# EAGLE design emitter (EAGLE 7.3.0)
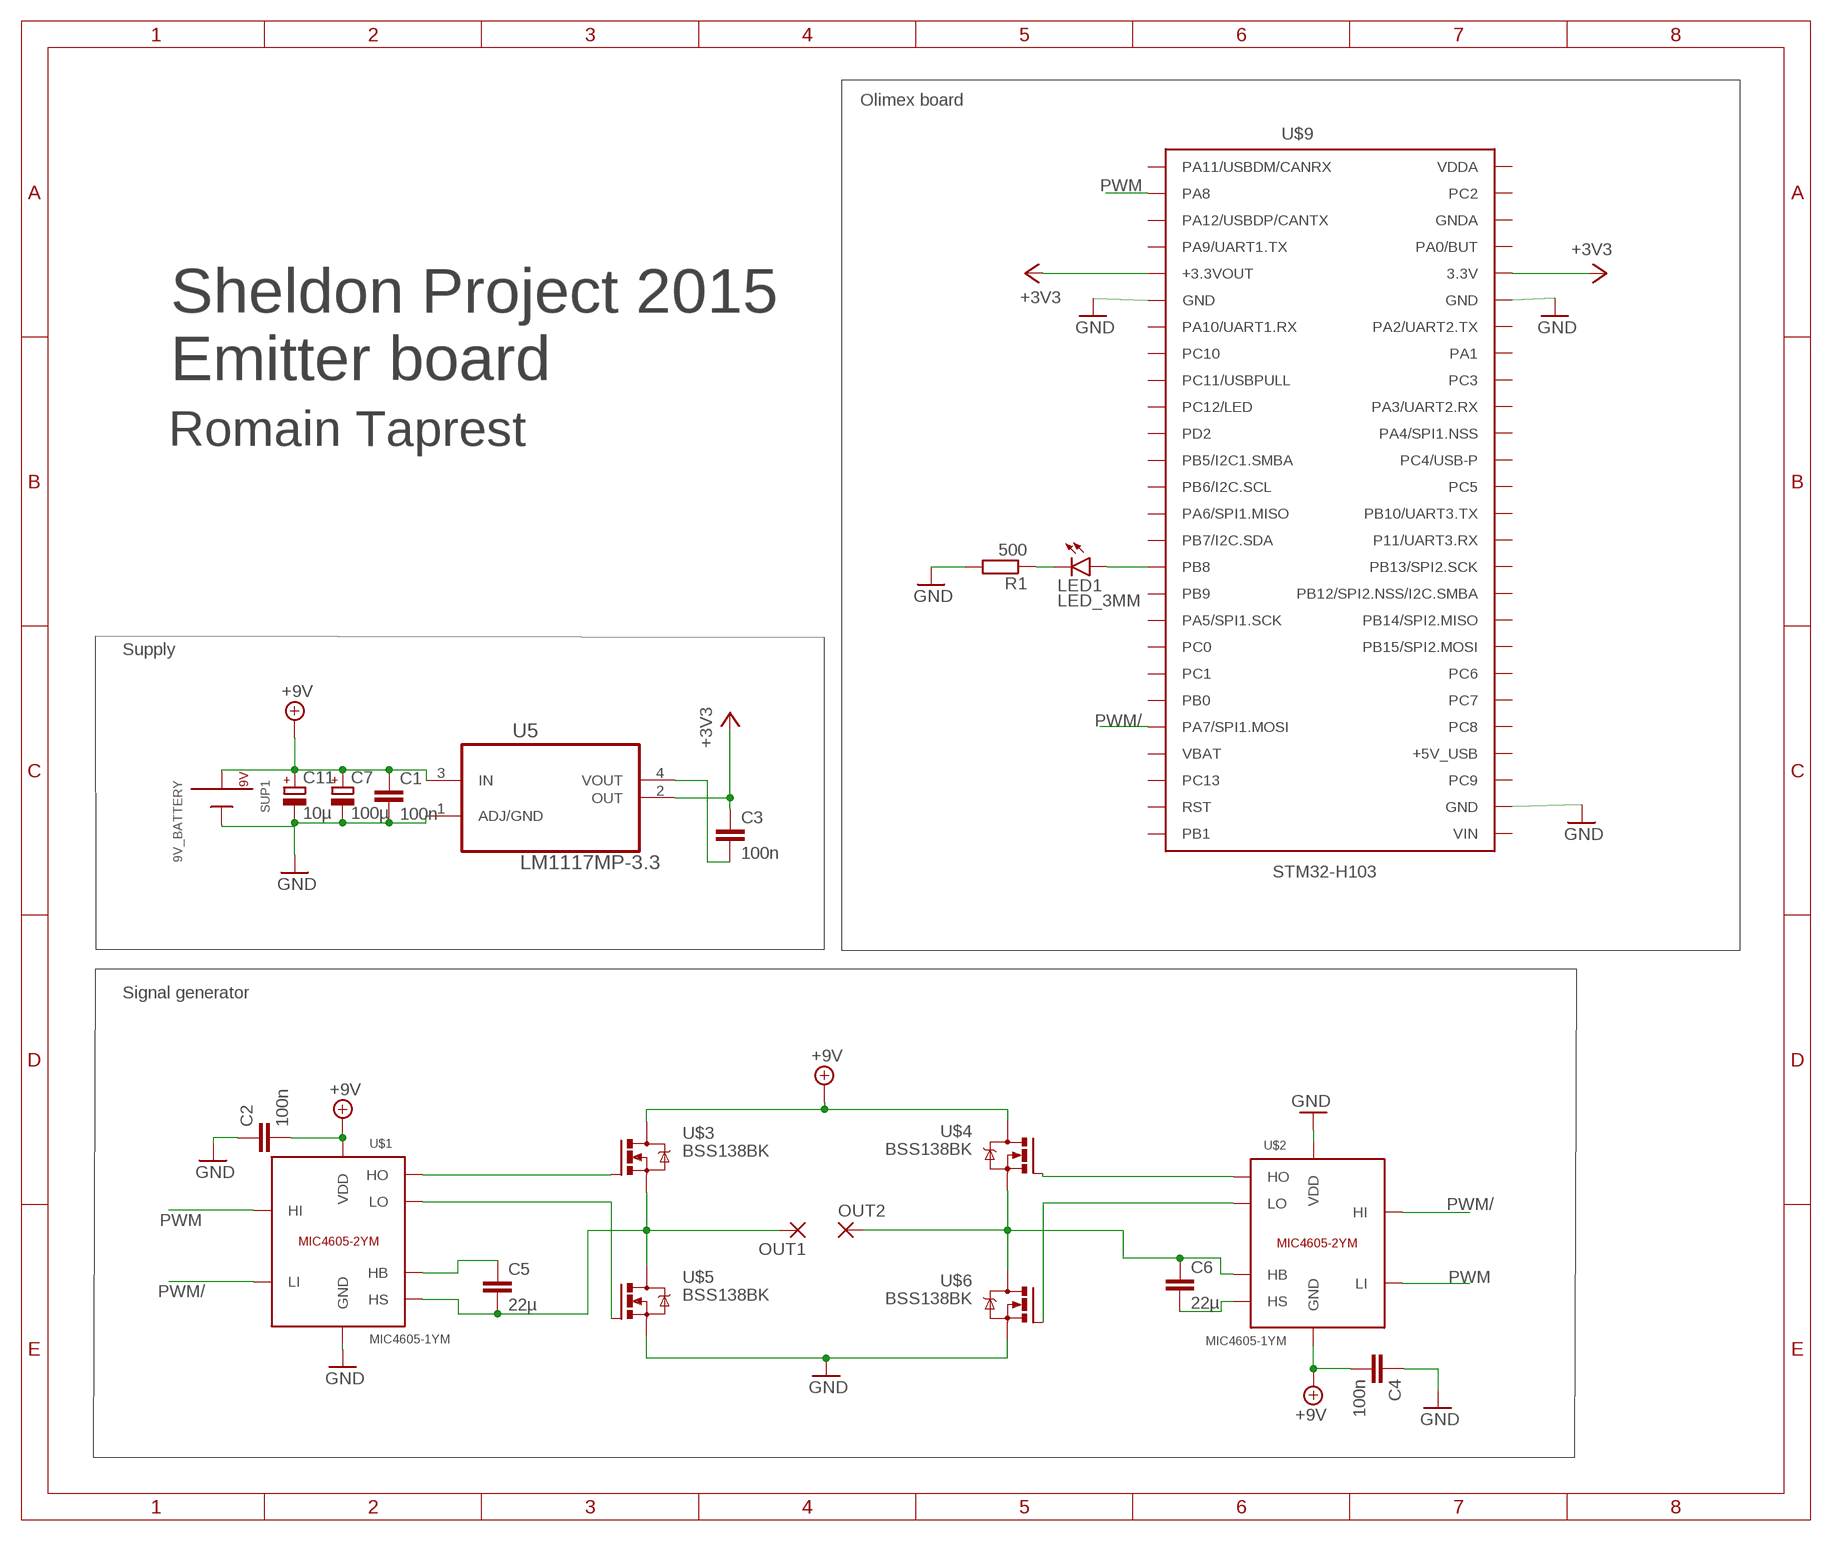
[diagram p0: schematic, sheet 1]

## Parts
C1  100n  C-EU050-025X075  [C050-025X075]
C2  100n  C-EU050-025X075  [C050-025X075]
C3  100n  C-EU050-025X075  [C050-025X075]
C4  100n  C-EU050-025X075  [C050-025X075]
C5  22µ  C-EU050-025X075  [C050-025X075]
C6  22µ  C-EU050-025X075  [C050-025X075]
C7  100µ  CPOL_DIAM5MM  [E2,5-6]
C11  10µ  CPOL_DIAM5MM  [E2,5-6]
LED1  LED_3MM  [LED3MM]
OUT1  2,54/1,0  [2,54/1,0]
OUT2  2,54/1,0  [2,54/1,0]
R1  500  R-EU_0207/10  [0207/10]
SUP1  9V_BATTERY  [9V_BATTERY]
U5  LM1117MP-3.3  [SOT230P696X180-4N]
U$1  MIC4605-1YM  [SOIC08]
U$2  MIC4605-1YM  [SOIC08]
U$3  BSS138BK  [SOT23]
U$4  BSS138BK  [SOT23]
U$5  BSS138BK  [SOT23]
U$6  BSS138BK  [SOT23]
U$9  STM32-H103  [STM32-H103]

## Nets
+3V3: C3.1 U5.2(OUT) U$9.3.3V U$9.+3.3VOUT
+9V: C1.1 C2.2 C4.2 C7.+ C11.+ SUP1.P$1(9V) U5.3(IN) U$1.1(VDD) U$2.7(GND) U$3.3(D) U$4.3(D)
GND: C1.2 C2.1 C4.1 C7.- C11.- R1.2 SUP1.P$2(GND) U5.1(ADJ/GND) U$1.7(GND) U$2.1(VDD) U$5.2(S) U$6.2(S) U$9.GND@1(GND) U$9.GND@2(GND) U$9.GND@3(GND)
N$1: C3.2 U5.4(VOUT)
N$2: LED1.K(C) R1.1
N$3: U$1.3(HO) U$3.1(G)
N$4: U$1.8(LO) U$5.1(G)
N$5: U$2.3(HO) U$4.1(G)
N$6: U$2.8(LO) U$6.1(G)
N$7: C5.1 U$1.2(HB)
N$9: C6.2 U$2.4(HS)
N$13: LED1.A U$9.PB8
OUT1: C5.2 OUT1.1(P) U$1.4(HS) U$3.2(S) U$5.3(D)
OUT2: C6.1 OUT2.1(P) U$2.2(HB) U$4.2(S) U$6.3(D)
PWM: U$1.5(HI) U$2.6(LI) U$9.PA8
PWM/: U$1.6(LI) U$2.5(HI) U$9.PA7/SPI1.MOSI
Unconnected: U$9.+5V_USB U$9.GNDA U$9.P11/UART3.RX U$9.PA0/BUT U$9.PA1 U$9.PA2/UART2.TX U$9.PA3/UART2.RX U$9.PA4/SPI1.NSS U$9.PA5/SPI1.SCK U$9.PA6/SPI1.MISO U$9.PA9/UART1.TX U$9.PA10/UART1.RX U$9.PA11/USBDM/CANRX U$9.PA12/USBDP/CANTX U$9.PB0 U$9.PB1 U$9.PB5/I2C1.SMBA U$9.PB6/I2C.SCL U$9.PB7/I2C.SDA U$9.PB9 U$9.PB10/UART3.TX U$9.PB12/SPI2.NSS/I2C.SMBA U$9.PB13/SPI2.SCK U$9.PB14/SPI2.MISO U$9.PB15/SPI2.MOSI U$9.PC0 U$9.PC1 U$9.PC2 U$9.PC3 U$9.PC4/USB-P U$9.PC5 U$9.PC6 U$9.PC7 U$9.PC8 U$9.PC9 U$9.PC10 U$9.PC11/USBPULL U$9.PC12/LED U$9.PC13 U$9.PD2 U$9.RST U$9.VBAT U$9.VDDA U$9.VIN

## Notes on the sheet
- Olimex board
- Sheldon Project 2015
  Emitter board
- Romain Taprest
- Supply
- Signal generator

## Library data of the parts
C1-C6 = resistor:C-EU: CAPACITOR, European symbol
C7 C11 = @Club_passif:CPOL_
LED1 = @Club_passif:LED_: LEDs, lumière quoi ! 1.8V < Vseuil < 2.0V environ
OUT1 OUT2 = wirepad:2,54/1,0: THROUGH-HOLE PAD
R1 = resistor:R-EU_: RESISTOR, European symbol
SUP1 = libSheldonDrone:9V_BATTERY
U5 = libSheldonDrone:LM1117MP-3.3: Linear regulators; MPN: LM1117MP-3.3; OC_FARNELL: 9778195; OC_NEWARK: 41K3470; PACKAGE: SOT223-3; SUPPLIER: NationalSemiconductor
U$1 U$2 = libSheldonDrone:MIC4605-1YM: MICREL SEMICONDUCTOR MIC4605-1YM DRIVER, MOSFET, 5.5V-16V, SOIC-8; FARNELL: 2382322
U$3-U$6 = libSheldonDrone:BSS138BK: NXP BSS138BK Transistor MOSFET, Canal N, 360 mA, 60 V, 1 ohm, 10 V, 1.1 V; FARNELL: 2053833
U$9 = libSheldonDrone:STM32-H103: Olimex STM32-H103 board

## Board
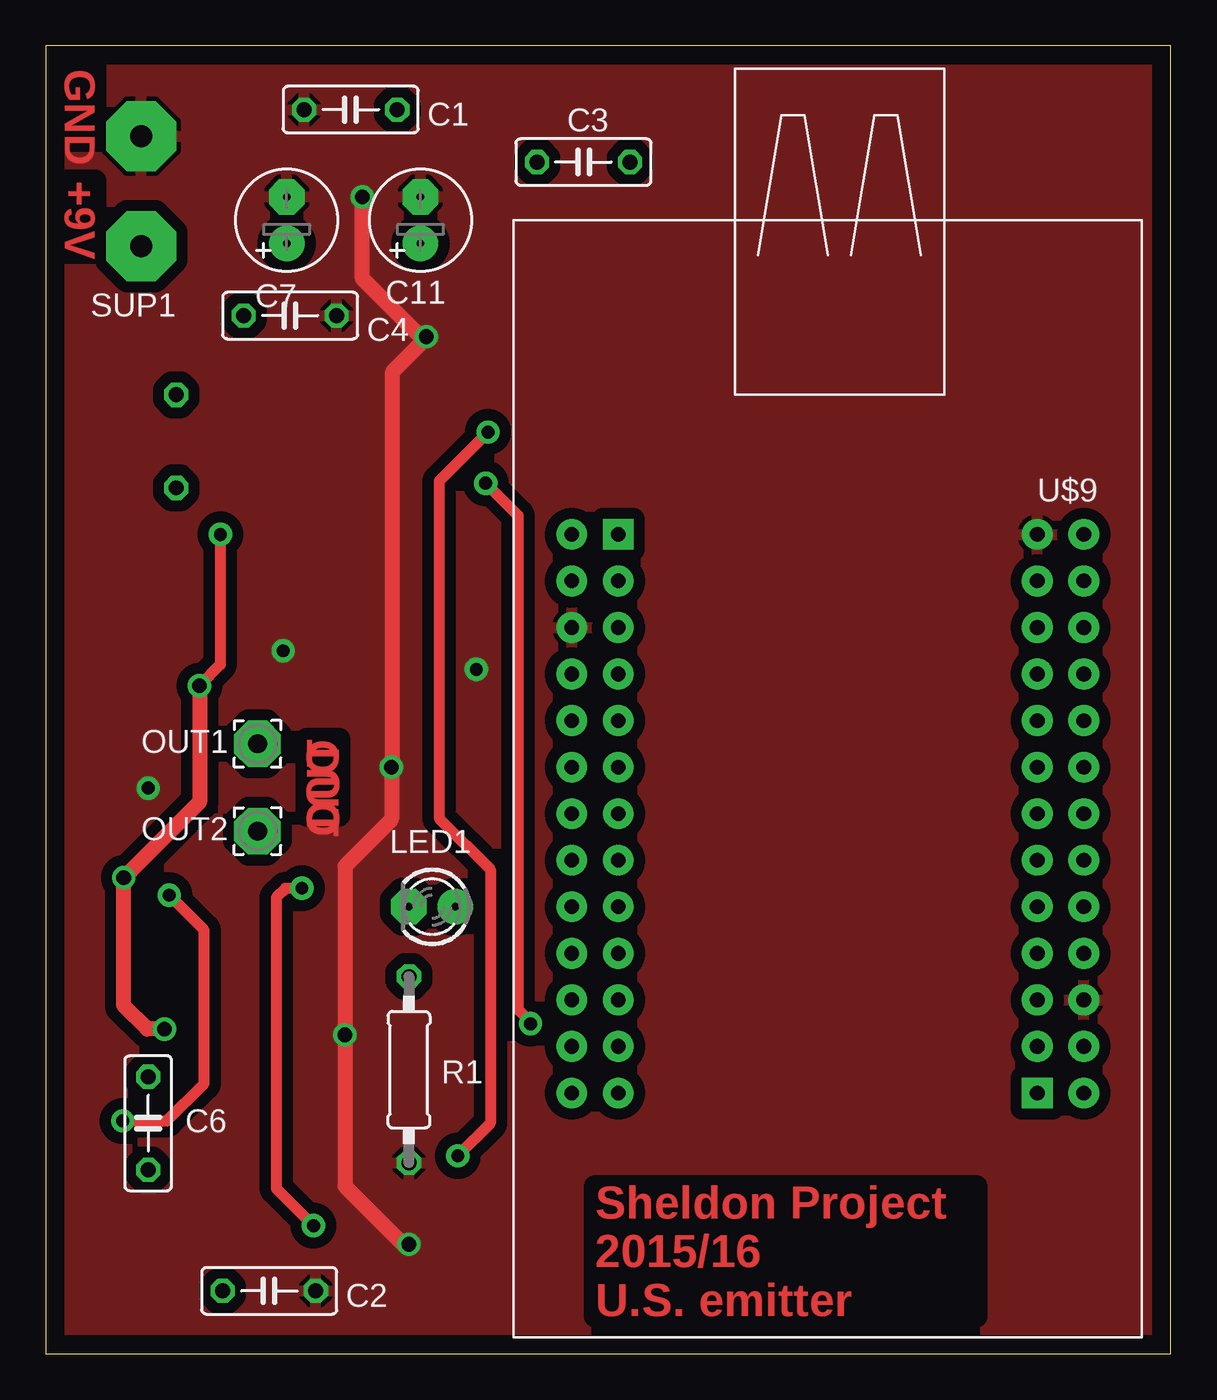
[diagram p1: board, top side]
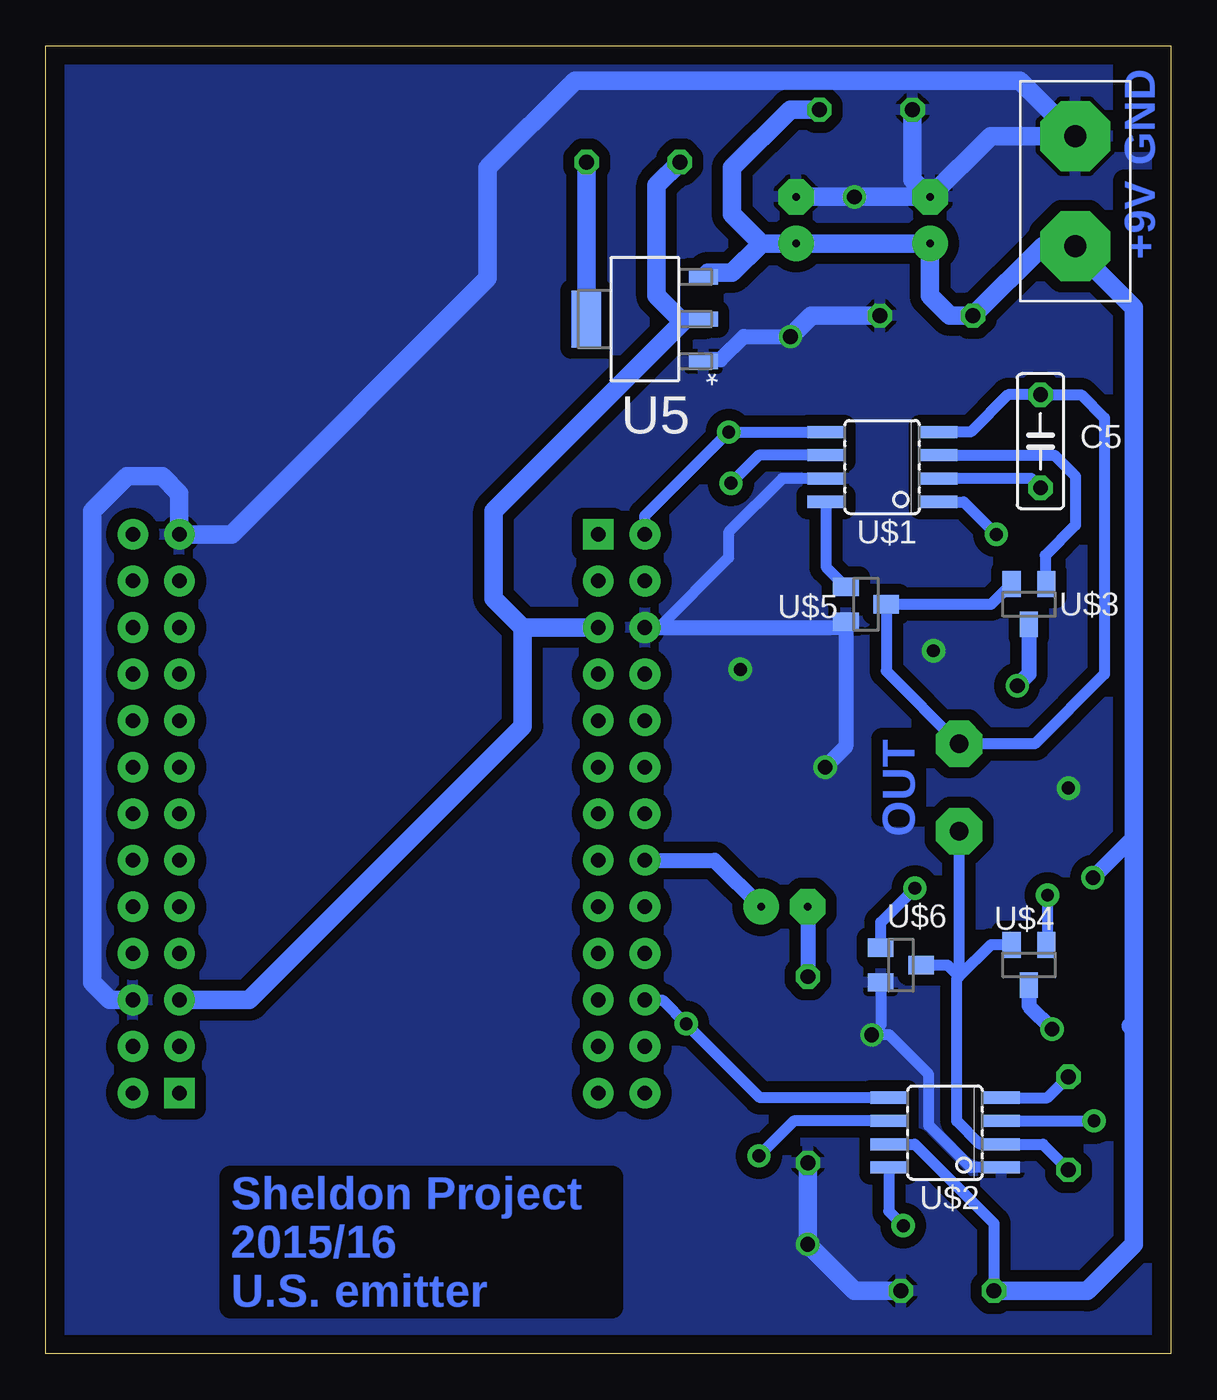
[diagram p2: board, bottom side, seen from below]

Size 61.39 x 71.36 mm. Coordinates in mm from the lower left corner, seen from the top.
Outline: 0,0 61.39,0 61.39,71.36 0,71.36 0,0
Copper layers (1*16): Top 0.035mm / dielectric 1.5mm / Bottom 0.035mm
Design rules "default": minimum track width 10mil, minimum drill 24mil, track to track 8mil, track to pad 8mil, pad to pad 8mil, via to via 8mil, smd to smd 8mil, copper to edge 40mil, drill to drill 8mil, minimum pad ring 10mil, minimum via ring 8mil, stop-mask expansion 4mil, vias tented up to drill 0mil, thermal gap 10mil

### Footprints (pad centres in the part's own frame; a part is rotated, then mirrored left to right if it is on the bottom)
C050-025X075 = drill 0.813 octagon: 1 -2.54,0; 2 2.54,0
E2,5-6 = drill 0.406 pad 1.93: + -1.27,0 | drill 0.406 pad 1.93 octagon: - 1.27,0
LED3MM = drill 0.406 pad 1.93: A -1.27,0 | drill 0.406 pad 1.93 octagon: K 1.27,0
2,54/1,0 = drill 1.016 pad 2.54 octagon: 1 0,0
0207/10 = drill 0.813 octagon: 1 -5.08,0; 2 5.08,0
9V_BATTERY = drill 1.2 pad 3.81 octagon: P$1 -3,0; P$2 3,0
SOT230P696X180-4N = smd 1.6 x 0.838: 1 -3.2,2.311; 2 -3.2,0; 3 -3.2,-2.311 | smd 1.6 x 3.099: 4 3.2,0
SOIC08 = smd 0.66 x 2.032: 1 -1.905,-3.073; 2 -0.635,-3.073; 3 0.635,-3.073; 4 1.905,-3.073; 5 1.905,3.073; 6 0.635,3.073; 7 -0.635,3.073; 8 -1.905,3.073
SOT23 = smd 1 x 1.4: 1 -0.95,-1.1; 2 0.95,-1.1; 3 0,1.1
STM32-H103 = drill 0.8 pad 1.676: 3.3V 25.4,-2.54; +3.3VOUT 5.08,-25.4; +5V_USB 2.54,-2.54; GND@1 5.08,-27.94; GND@2 25.4,0; GND@3 0,-2.54; GNDA 27.94,-2.54; P11/UART3.RX 12.7,-2.54; PA0/BUT 27.94,0; PA1 22.86,0; PA2/UART2.TX 22.86,-2.54; PA3/UART2.RX 20.32,0; PA4/SPI1.NSS 17.78,-2.54; PA5/SPI1.SCK 20.32,-27.94; PA6/SPI1.MISO 15.24,-27.94; PA7/SPI1.MOSI 25.4,-27.94; PA8 0,-27.94; PA9/UART1.TX 2.54,-27.94; PA10/UART1.RX 7.62,-25.4; PA12/USBDP/CANTX 2.54,-25.4; PB0 25.4,-25.4; PB1 30.48,-27.94; PB5/I2C1.SMBA 12.7,-27.94; PB6/I2C.SCL 15.24,-25.4; PB7/I2C.SDA 17.78,-25.4; PB8 17.78,-27.94; PB9 20.32,-25.4; PB10/UART3.TX 15.24,0; PB12/SPI2.NSS/I2C.SMBA 10.16,-2.54; PB13/SPI2.SCK 12.7,0; PB14/SPI2.MISO 10.16,0; PB15/SPI2.MOSI 7.62,-2.54; PC0 22.86,-25.4; PC1 22.86,-27.94; PC2 30.48,0; PC3 20.32,-2.54; PC4/USB-P 17.78,0; PC5 15.24,-2.54; PC6 7.62,0; PC7 5.08,-2.54; PC8 5.08,0; PC9 2.54,0; PC10 7.62,-27.94; PC11/USBPULL 10.16,-25.4; PC12/LED 10.16,-27.94; PC13 27.94,-27.94; PD2 12.7,-25.4; RST 30.48,-25.4; VBAT 27.94,-25.4; VIN 0,0 | drill 0.8 pad 1.676 square: PA11/USBDM/CANRX 0,-25.4; VDDA 30.48,-2.54

### Placement (x,y rotation side)
C1  16.64,67.88 180 top
C2  12.19,3.43 180 top
C3  29.34,65.02 0 top
C4  13.34,56.64 180 top
C5  7.11,49.78 90 bottom
C6  5.59,12.57 90 top
C7  13.14,61.85 90 top
C11  20.45,61.85 90 top
LED1  21.08,24.38 180 top
OUT1  11.56,33.27 0 top
OUT2  11.56,28.51 0 top
R1  19.81,15.49 270 top
SUP1  5.21,63.44 90 bottom
U5  28.7,56.45 180 bottom
U$1  15.75,48.39 90 bottom
U$2  12.32,12.06 90 bottom
U$3  7.75,40.89 180 bottom
U$4  7.75,21.21 180 bottom
U$5  16.64,40.89 270 bottom
U$6  14.73,21.21 270 bottom
U$9  56.64,44.7 270 top

### Tracks (layer width: path | path; a pad name or v marks a point on that pad's centre or on a via)
+3V3
  Bottom 1.016: U5.2 26.48,56.45 | 26.48,56.45 26.8,56.45 28.07,57.72 28.07,63.75 C3.1 | U$9.+3.3VOUT 35.37,39.62 | 35.37,39.62 36.96,41.21 36.96,45.97 26.48,56.45 | U$9.3.3V 50.29,19.3 35.37,34.23 35.37,39.62
+9V  (via drill 0.7 pad 1.27, 0.8 pad 1.27)
  Top 0.61: v9.53,44.7 9.53,37.59 v8.38,36.45
  Top 0.813: v6.48,17.72 5.52,17.72 4.25,18.99 v4.25,25.97 8.38,30.1 v8.38,36.45
  Bottom 0.61: SUP1.P$1 5.21,60.26 | U$1.1 11.3,46.48 v9.53,44.7 | U$2.7 13.97,11.43 9.65,7.11 C2.2
  Bottom 0.813: U$4.3 7.75,18.99 v6.48,17.72 | v4.25,25.97 2.03,28.19 | U$3.3 7.75,37.08 v8.38,36.45
  Bottom 1.016: C2.2 4.57,3.43 2.03,5.97 2.03,17.72 | 2.03,17.72 2.19,17.88 2.03,18.03 | 22.35,60.58 C11.+ C7.+ 13.14,57.72 12.06,56.64 C4.2 7,60.44 SUP1.P$1 | 22.35,60.58 23.94,58.99 25.27,58.99 U5.3 | C1.1 20.77,67.88 23.94,64.71 23.94,62.17 22.35,60.58 | 2.03,17.72 2.03,28.19 2.03,57.09 5.21,60.26
GND  (via drill 0.7 pad 1.27, 0.8 pad 1.27)
  Top 0.813: v17.27,63.12 17.27,58.67 20.45,55.5 v20.77,55.5 20.83,55.5 18.92,53.59 18.92,31.88 18.86,31.94 v18.86,32 18.86,29.15 16.32,26.61 v16.32,17.4 16.32,9.14 19.49,5.97 v19.81,5.97
  Bottom 0.61: U$5.2 | U$6.2 15.83,17.89 v16.32,17.4 15.37,17.4 13.21,15.24 13.21,12.45 10.92,10.16 U$2.1 | U$1.7 21.21,47.75 24.13,44.83 24.13,43.43 27.94,39.62
  Bottom 0.813: U5.1 25.41,54.23 24.57,54.23 23.3,55.5 v20.77,55.5 | U$9.GND@1 27.94,39.62 18.06,39.62 U$5.2 17.74,33.13 v18.86,32
  Bottom 1.016: R1.2 v19.81,5.97 17.27,3.43 C2.1 | C7.- 9.83,66.44 SUP1.P$2 8.24,69.47 32.51,69.47 37.27,64.71 37.27,58.67 51.24,44.7 U$9.GND@3 54.1,46.93 55.05,47.88 56.96,47.88 58.86,45.97 58.86,20.26 57.91,19.3 U$9.GND@2 | C1.2 14.1,64.07 C7.- | C11.- v17.27,63.12 C7.- | C4.1 19.62,56.64 v20.77,55.5
  other vias: 23.5,37.34 5.59,30.86 12.95,38.35
  pour Bottom (isolate 0.61): -3.56,74.68 68.58,74.68 68.58,-3.05 -3.56,-3.05
  pour Top (isolate 0.61): -5.59,77.22 72.64,77.22 72.64,-5.59 -5.59,-5.59
N$1
  Bottom 1.016: C3.2 31.88,56.48 U5.4
N$2
  Bottom 0.813: LED1.K R1.1
N$3
  Bottom 0.61: U$1.3 6.35,49.02 5.21,47.88 5.21,45.21 6.86,43.56 6.86,42.05 U$3.1
N$4
  Bottom 0.61: U$1.8 18.82,42.93 U$5.1
N$5  (via drill 0.7 pad 1.27)
  Top 0.61: v4.19,12.7 6.6,12.7 8.64,14.73 8.64,23.11 v6.73,25.02
  Bottom 0.61: U$2.3 v4.19,12.7 | v6.73,25.02 6.73,22.38 U$4.1
N$6  (via drill 0.7 pad 1.27)
  Top 0.61: v13.97,25.4 13.08,25.4 12.57,24.89 12.57,9.02 13.59,8 v14.61,6.99
  Bottom 0.61: U$6.1 15.83,23.54 v13.97,25.4 | U$2.8 15.39,7.77 v14.61,6.99
N$7
  Bottom 0.61: C5.1 7.62,47.75 U$1.2
N$9
  Bottom 0.61: U$2.4 6.73,13.97 C6.2
N$13
  Bottom 0.813: U$9.PB8 24.89,26.92 LED1.A
OUT1
  Bottom 0.61: U$3.2 9.8,40.89 U$5.3 15.54,37.25 OUT1.1 7.43,33.27 3.62,37.08 3.62,51.05 4.89,52.32 C5.2 8.89,52.32 10.92,50.29 U$1.4
OUT2
  Bottom 0.61: OUT2.1 11.56,20.57 | U$4.2 9.82,22.31 11.56,20.57 | U$6.3 12.19,21.21 11.56,20.57 | C6.1 6.99,11.43 U$2.2 10.41,11.43 11.68,12.7 11.68,20.45 11.56,20.57
PWM  (via drill 0.7 pad 1.27)
  Top 0.61: v24.13,50.29 21.46,47.62 21.46,29.21 24.26,26.42 24.26,12.57 v22.48,10.79
  Bottom 0.61: U$9.PA8 28.7,45.72 v24.13,50.29 U$1.5 | U$2.6 20.57,12.7 v22.48,10.79
PWM/  (via drill 0.7 pad 1.27)
  Top 0.61: v24,47.5 25.78,45.72 25.78,18.8 26.45,18.13 v26.45,18
  Bottom 0.61: U$9.PA7/SPI1.MOSI 27.75,19.3 v26.45,18 22.42,13.97 U$2.5 | U$1.6 22.48,49.02 v24,47.5

### Text on the board
Top: GND | +9V | OUT | OUT | OUT | OUT | Sheldon Project / 2015/16 / U.S. emitter
Bottom: GND | +9V | OUT | Sheldon Project / 2015/16 / U.S. emitter